# Altium schematic sheet LoRa.SchDoc: =ProjectName
size A4; CheckedBy: DatNB; Author: Ven; CompanyName: Nacentech; Organization: IMET
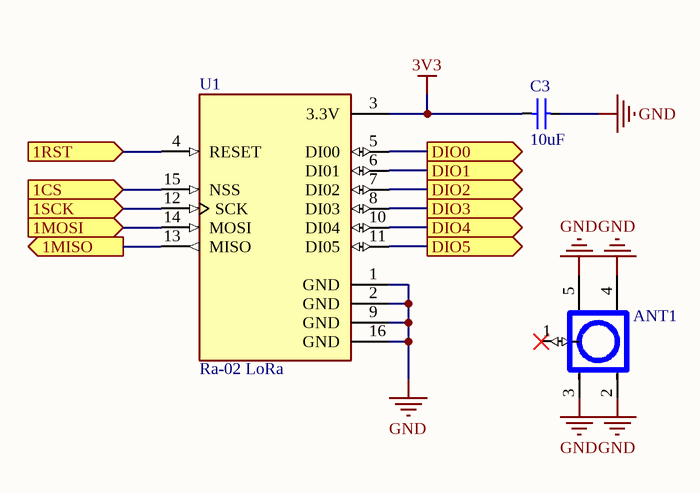
[diagram p0: LoRa.SchDoc]

## Parts
ANT1  anten  [SMA-RA]  (value not drawn)
C3  10uF  [CAP_0805]
U1  Ra-02 LoRa  [Ra-02]

## Ports
1CS (in), 1MISO (out), 1MOSI (in), 1RST (in), 1SCK (in), DIO0 (out), DIO1 (out), DIO2 (out), DIO3 (out), DIO4 (out), DIO5 (out)

## Nets
3V3: C3.2 U1.3(3.3V)
GND: ANT1.2 ANT1.3 ANT1.4 ANT1.5 C3.1 U1.1(GND) U1.2(GND) U1.9(GND) U1.16(GND)
1CS: U1.15(NSS) ; port 1CS
1MISO: U1.13(MISO) ; port 1MISO
1MOSI: U1.14(MOSI) ; port 1MOSI
1RST: U1.4(RESET) ; port 1RST
1SCK: U1.12(SCK) ; port 1SCK
DIO0: U1.5(DI00) ; port DIO0
DIO1: U1.6(DI01) ; port DIO1
DIO2: U1.7(DI02) ; port DIO2
DIO3: U1.8(DI03) ; port DIO3
DIO4: U1.10(DI04) ; port DIO4
DIO5: U1.11(DI05) ; port DIO5

Not connected (* = marked no-connect by the designer): ANT1 1*

## Notes on the sheet
- Project:
- Page Contents:
- Size:
- Date:
- A4
- Checked by:
- Time:
- Revision:
- Sheet
- of
- File:

## Library data of the parts
ANT1 = anten: Anten 5 pins
C3 = CapSMD: Capacitor; Value: 33p; Published: 8-Jun-2000; LatestRevisionDate: 17-Jul-2002; LatestRevisionNote: Re-released for DXP Platform.; PackageReference: RAD-0.3; Publisher: Altium Limited
U1 = Ra-02 LoRa: LoRa Module Ra-02